# Altium project 转台控制板-V1.3.PrjPCB
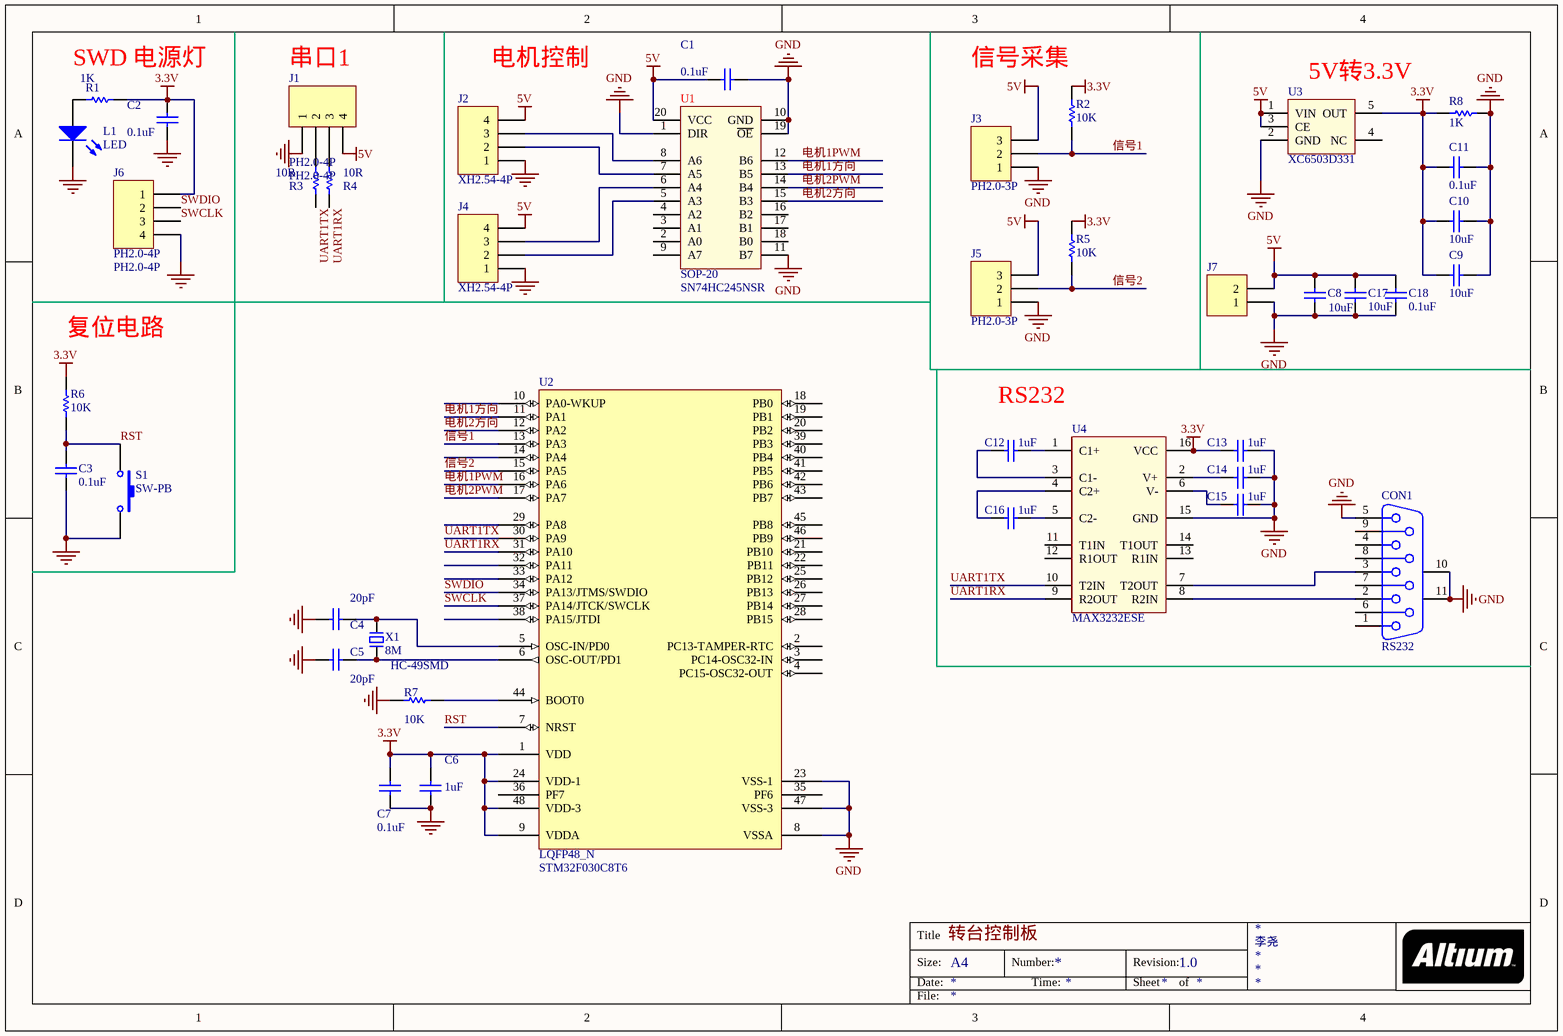
[diagram p0: RevolvingStageController.SchDoc]
1 sheet, 41 parts. Net scope: global (net labels, ports and power ports of the same name join across sheets).
Board file: RevolvingStageController.PcbDoc

## Sheet RevolvingStageController.SchDoc: 转台控制板
size A4; Address1: 李尧; Revision: 1.0; Time: 2016年3月25日14:44:48

### Parts
C1  0.1uF  [0603]
C2  0.1uF  [0603]
C3  0.1uF  [0603]
C4  20pF  [0603]
C5  20pF  [0603]
C6  1uF  [0603]
C7  0.1uF  [0603]
C8  10uF  [0603]
C9  10uF  [0603]
C10  10uF  [0603]
C11  0.1uF  [0603]
C12  1uF  [0603]
C13  1uF  [0603]
C14  1uF  [0603]
C15  1uF  [0603]
C16  1uF  [0603]
C17  10uF  [0603]
C18  0.1uF  [0603]
CON1  RS232  [DSUB1.385-2H9-M]
J1  PH2.0-4P  [PH2.0-4P]
J2  XH2.54-4P  [XH2.54-4]
J3  PH2.0-3P  [PH2.0-3P]
J4  XH2.54-4P  [XH2.54-4]
J5  PH2.0-3P  [PH2.0-3P]
J6  PH2.0-4P  [PH2.0-4P]
J7  PH2.0-2P  [PH2.0-2P]  (value not drawn)
L1  LED  [0603]
R1  1K  [0603]
R2  10K  [0603]
R3  10R  [0603]
R4  10R  [0603]
R5  10K  [0603]
R6  10K  [0603]
R7  10K  [0603]
R8  1K  [0603]
S1  SW-PB  [SW-KEY]
U1  SOP-20  value SN74HC245NSR  [SOP-20]
U2  LQFP48_N  value STM32F030C8T6  [LQFP48_N]
U3  XC6503D331  [SOT23-5]
U4  MAX3232ESE  [SOIC-16N]
X1  8M  value HC-49SMD  [HC-49SMD]

### Nets
3.3V: C2.1 C6.1 C7.1 C9.1 C10.2 C11.2 C13.2 J6.1 R1.2 R2.1 R5.1 R6.1 R8.2 U2.1(VDD) U2.9(VDDA) U2.24(VDD-1) U2.48(VDD-3) U3.5(OUT) U4.16(VCC)
5V: C1.1 C8.2 C17.2 C18.2 J1.4 J2.4 J3.3 J4.4 J5.3 J7.2 U1.20(VCC) U3.1(VIN) U3.3(CE)
GND: C1.2 C2.2 C3.2 C4.1 C5.1 C6.2 C7.2 C8.1 C9.2 C10.1 C11.1 C13.1 C14.1 C15.1 C17.1 C18.1 CON1.5 CON1.10(MH1) CON1.11(MH2) J1.1 J2.1 J3.1 J4.1 J5.1 J6.4 J7.1 L1.2(K) R7.1 R8.1 S1.2 U1.1(DIR) U1.10(GND) U1.11(B7) U1.19(~{OE}) U2.8(VSSA) U2.23(VSS-1) U2.47(VSS-3) U3.2(GND) U4.15(GND)
RST: C3.1 R6.2 S1.1 U2.7(NRST)
SWCLK: J6.3 U2.37(PA14/JTCK/SWCLK)
SWDIO: J6.2 U2.34(PA13/JTMS/SWDIO)
UART1RX: R4.2 U2.31(PA10) U4.9(R2OUT)
UART1TX: R3.2 U2.30(PA9) U4.10(T2IN)
信号1: J3.2 R2.2 U2.13(PA3)
信号2: J5.2 R5.2 U2.15(PA5)
电机1PWM: U1.12(B6) U2.16(PA6)
电机1方向: U1.13(B5) U2.11(PA1)
电机2PWM: U1.14(B4) U2.17(PA7)
电机2方向: U1.15(B3) U2.12(PA2)
NetC4_2: C4.2 U2.5(OSC-IN/PD0) X1.2
NetC5_2: C5.2 U2.6(OSC-OUT/PD1) X1.1
NetC12_1: C12.1 U4.1(C1+)
NetC12_2: C12.2 U4.3(C1-)
NetC14_2: C14.2 U4.2(V+)
NetC15_2: C15.2 U4.6(V-)
NetC16_1: C16.1 U4.5(C2-)
NetC16_2: C16.2 U4.4(C2+)
NetCON1_2: CON1.2 U4.8(R2IN)
NetCON1_3: CON1.3 U4.7(T2OUT)
NetJ1_2: J1.2 R3.1
NetJ1_3: J1.3 R4.1
NetJ2_2: J2.2 U1.7(A5)
NetJ2_3: J2.3 U1.8(A6)
NetJ4_2: J4.2 U1.5(A3)
NetJ4_3: J4.3 U1.6(A4)
NetL1_1: L1.1(A) R1.1
NetR7_2: R7.2 U2.44(BOOT0)

Not connected (* = marked no-connect by the designer): CON1 1 4 6 7 8 9; U1 2(A0) 3(A1) 4(A2) 9(A7) 16(B2) 17(B1) 18(B0); U2 2(PC13-TAMPER-RTC) 3(PC14-OSC32-IN) 4(PC15-OSC32-OUT) 10(PA0-WKUP) 14(PA4) 18(PB0) 19(PB1) 20(PB2) 21(PB10) 22(PB11) 25(PB12) 26(PB13) 27(PB14) 28(PB15) 29(PA8) 32(PA11) 33(PA12) 35(PF6) 36(PF7) 38(PA15/JTDI) 39(PB3) 40(PB4) 41(PB5) 42(PB6) 43(PB7) 45(PB8) 46(PB9); U3 4(NC); U4 11(T1IN) 12(R1OUT) 13(R1IN) 14(T1OUT)

### Notes on the sheet
- SWD 电源灯
- 串口1
- (near J2) 电机控制
- 信号采集
- (near U3) 5V转3.3V
- (near R6) 复位电路
- RS232
- Title
- Size:
- Date:
- A4
- Number:
- Time:
- Revision:
- Sheet
- of
- File:

### Library data of the parts
C1-C16 = Cap: Capacitor; Published: 8-Jun-2000; LatestRevisionDate: 17-Jul-2002; LatestRevisionNote: Re-released for DXP Platform.; PackageReference: RAD-0.3; Publisher: Altium Limited; PackageDescription: Radial Cap, Thru-Hole; 2 Leads; 0.3 in Pin Spacing
  C1-C3 C7 C11: Value: 0.1uF
  C4 C5: Value: 20pF
  C6 C12-C16: Value: 1uF
  C8-C10: Value: 10uF
C17 C18 = Cap: 电容0603; Published: 8-Jun-2000; LatestRevisionDate: 17-Jul-2002; LatestRevisionNote: Re-released for DXP Platform.; PackageReference: RAD-0.3; Publisher: Altium Limited; PackageDescription: Radial Cap, Thru-Hole; 2 Leads; 0.3 in Pin Spacing
  C17: Value: 10uF
  C18: Value: 0.1uF
CON1 = D Connector 9: Receptacle Assembly, 9 Position, Right Angle; PackageDocument: O; Positions: 9; Published: 15-Jun-2001; LatestRevisionDate: 17-Jul-2002; LatestRevisionNote: Re-released for DXP Platform.; DatasheetDocument: 1-Sep-1999; PackageReference: 788750; Publisher: Altium Limited; Orientation: Right Angle; Gender: Receptacle
J1 J6 = Header 4: Header, 4-Pin; LatestRevisionDate: 17-Jul-2002; LatestRevisionNote: Re-released for DXP Platform.; Publisher: Altium Limited; Value: PH2.0-4P
J2 J4 = Header 4: Header, 4-Pin; Value: PH2.0-4P; LatestRevisionDate: 17-Jul-2002; LatestRevisionNote: Re-released for DXP Platform.; Publisher: Altium Limited
J3 J5 = Header 3: Header, 3-Pin; LatestRevisionDate: 17-Jul-2002; LatestRevisionNote: Re-released for DXP Platform.; Publisher: Altium Limited
J7 = PH2.0-2P: 插座PH2.0-2P; LatestRevisionDate: 17-Jul-2002; LatestRevisionNote: Re-released for DXP Platform.; Publisher: Altium Limited
R1-R8 = Res1: Resistor; Published: 8-Jun-2000; LatestRevisionDate: 17-Jul-2002; LatestRevisionNote: Re-released for DXP Platform.; PackageReference: AXIAL-0.3; Publisher: Altium Limited; PackageDescription: Axial Device, Thru-Hole; 2 Leads; 0.3 in Pin Spacing
  R1 R8: Value: 1K
  R2 R5-R7: Value: 10K
  R3 R4: Value: 10R
S1 = SW-PB: Switch; Published: 24-Mar-1999; LatestRevisionDate: 17-Jul-2002; LatestRevisionNote: Re-released for DXP Platform.; PackageReference: SPST-2; Publisher: Altium Limited; PackageDescription: Switch; 2 Leads
U1 = 74HC245
U2 = STM32F030C8T6: STM32 ARM-based 32-bit MCU with 64 Kbytes Flash, 48-pin LQFP, Industrial Temperature; Published: *; DatasheetVersion: *; PackageVersion: *; PackageReference: *; Publisher: *; PackageDescription: *; ComponentLink1Description: *; ComponentLink1URL: *; ComponentLink2Description: *; ComponentLink2URL: *
U3 = XC6503Dxxx: Value: XC6503D331
U4 = MAX3232
X1 = XTAL